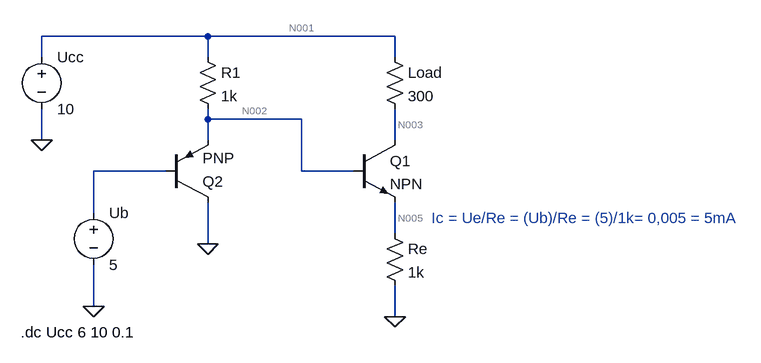
[diagram p0: schematic schemat2.asc]
schemat2.asc, the LTspice schematic file:
Version 4
SHEET 1 880 680
WIRE -320 48 -576 48
WIRE -32 48 -320 48
WIRE -576 80 -576 48
WIRE -320 80 -320 48
WIRE -32 80 -32 48
WIRE -320 176 -320 160
WIRE -176 176 -320 176
WIRE -576 208 -576 160
WIRE -320 208 -320 176
WIRE -32 208 -32 160
WIRE -384 256 -496 256
WIRE -176 256 -176 176
WIRE -96 256 -176 256
WIRE -496 320 -496 256
WIRE -32 352 -32 304
WIRE -320 368 -320 304
WIRE -496 464 -496 400
WIRE -32 480 -32 432
FLAG -496 464 0
FLAG -576 208 0
FLAG -32 480 0
FLAG -320 368 0
SYMBOL voltage -496 304 R0
WINDOW 123 0 0 Left 0
WINDOW 39 0 0 Left 0
SYMATTR InstName Ub
SYMATTR Value 5
SYMBOL npn -96 208 R0
SYMATTR InstName Q1
SYMBOL res -48 64 R0
SYMATTR InstName Load
SYMATTR Value 300
SYMBOL res -48 336 R0
SYMATTR InstName Re
SYMATTR Value 1k
SYMBOL voltage -576 64 R0
SYMATTR InstName Ucc
SYMATTR Value 10
SYMBOL pnp -384 304 M180
SYMATTR InstName Q2
SYMBOL res -336 64 R0
SYMATTR InstName R1
SYMATTR Value 1k
TEXT -608 504 Left 2 !.dc Ucc 6 10 0.1
TEXT 24 328 Left 2 ;Ic = Ue/Re = (Ub)/Re = (5)/1k= 0,005 = 5mA

The netlist it stands for:
* schemat2.asc
V§Ub N004 0 5
Q1 N003 N002 N005 0 NPN
R§Load N001 N003 300
Re N005 0 1k
V§Ucc N001 0 10
Q2 0 N004 N002 0 PNP
R1 N001 N002 1k
.model NPN NPN
.model PNP PNP
.lib standard.bjt
.dc Ucc 6 10 0.1
* Ic = Ue/Re = (Ub)/Re = (5)/1k= 0,005 = 5mA
.backanno
.end

* Results of the author's LTspice run, read from the files saved beside the schematic
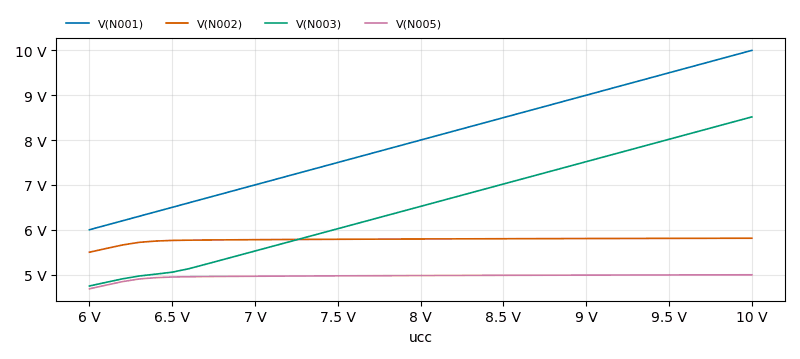
[diagram p1: DC transfer characteristic of schemat2.asc, plotted from the saved traces]
* DC transfer characteristic, 1 run:
*   V(N001): 6 V at ucc=6 V, 10 V at ucc=10 V, min 6 V, max 10 V
*   V(N002): 5.499 V at ucc=6 V, 5.811 V at ucc=10 V, min 5.499 V, max 5.811 V
*   V(N003): 4.745 V at ucc=6 V, 8.516 V at ucc=10 V, min 4.745 V, max 8.516 V
*   V(N005): 4.683 V at ucc=6 V, 4.995 V at ucc=10 V, min 4.683 V, max 4.995 V